# EAGLE design signalgen (EAGLE 7.1.0)
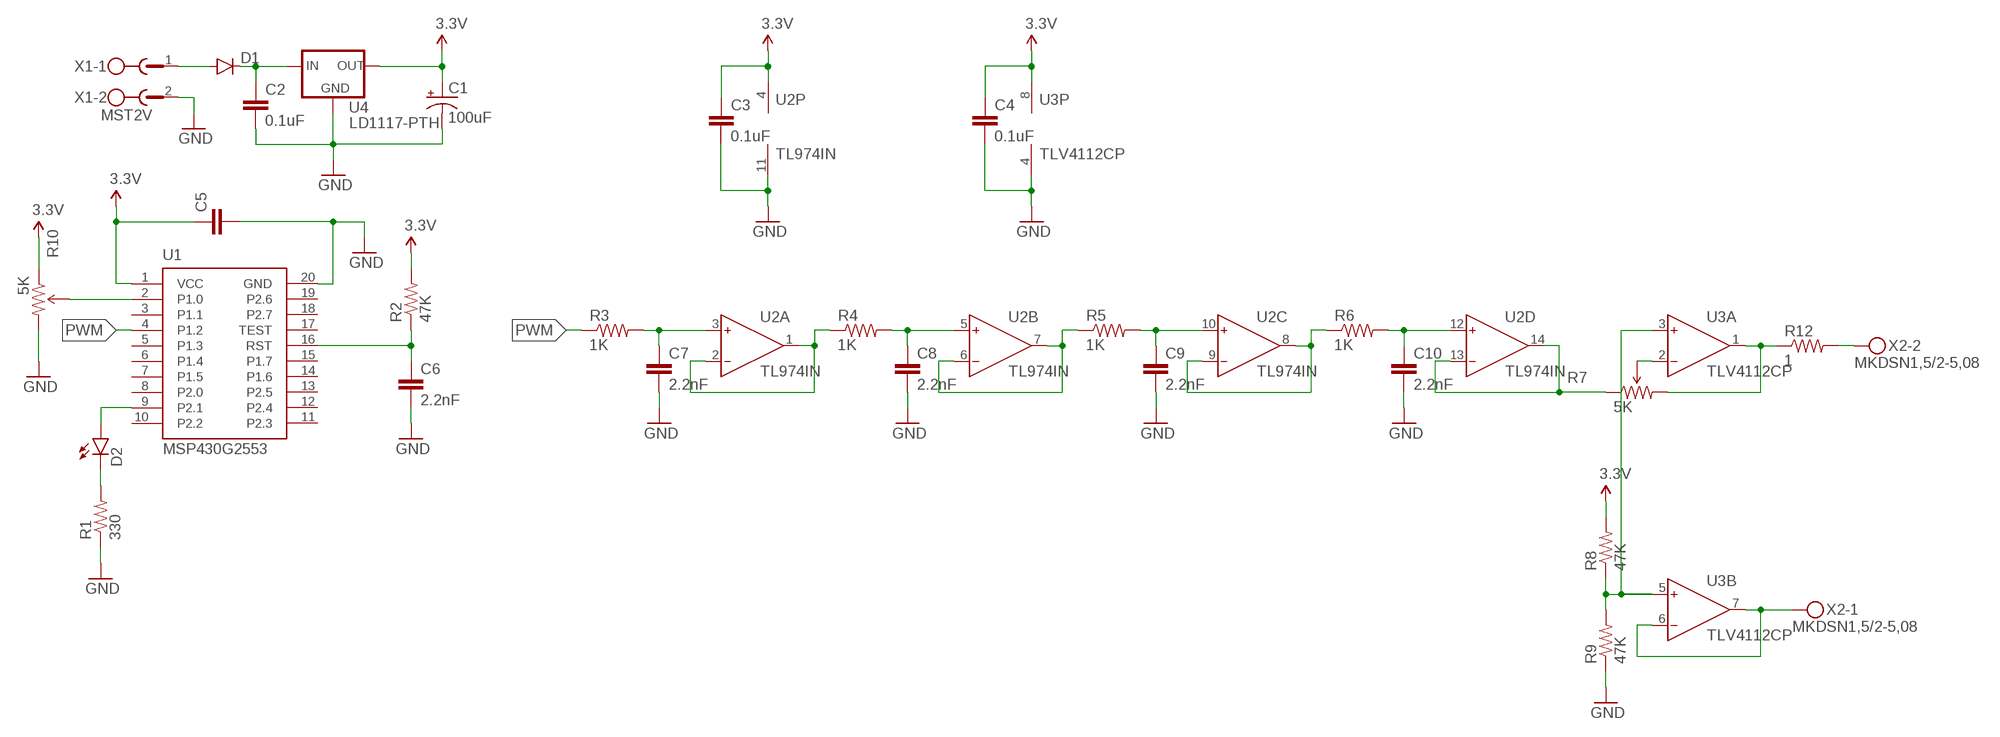
[diagram p0: schematic, sheet 1]

## Parts
C1  100uF  CAP_POLPTH1  [CPOL-RADIAL-100UF-25V]
C2  0.1uF  CAPPTH  [CAP-PTH-SMALL]
C3  0.1uF  CAPPTH  [CAP-PTH-SMALL]
C4  0.1uF  CAPPTH  [CAP-PTH-SMALL]
C5  CAPPTH  [CAP-PTH-SMALL]
C6  2.2nF  CAPPTH  [CAP-PTH-SMALL]
C7  2.2nF  CAPPTH  [CAP-PTH-SMALL]
C8  2.2nF  CAPPTH  [CAP-PTH-SMALL]
C9  2.2nF  CAPPTH  [CAP-PTH-SMALL]
C10  2.2nF  CAPPTH  [CAP-PTH-SMALL]
D1  DIODEPTH  [DIODE-1N4001]
D2  LED-3MM-NO_SILK  [LED3MM-NS]
R1  330  1KOHM-1/4W-1%(PTH)VERT  [AXIAL-0.1]
R2  47K  1KOHM-1/4W-1%(PTH)  [AXIAL-0.3]
R3  1K  1KOHM-1/4W-1%(PTH)VERT  [AXIAL-0.1]
R4  1K  1KOHM-1/4W-1%(PTH)  [AXIAL-0.3]
R5  1K  1KOHM-1/4W-1%(PTH)VERT  [AXIAL-0.1]
R6  1K  1KOHM-1/4W-1%(PTH)  [AXIAL-0.3]
R7  5K  TRIMPOTPTH  [TRIM_POT_PTH]
R8  47K  1KOHM-1/4W-1%(PTH)  [AXIAL-0.3]
R9  47K  1KOHM-1/4W-1%(PTH)  [AXIAL-0.3]
R10  5K  TRIMPOTPTH  [TRIM_POT_PTH]
R12  1  RESISTORPTH-1W  [AXIAL-0.6]
U1  MSP430G2553  [DIP-20]
U2  TL974IN  [DIP-14]
U3  TLV4112CP  [DIP-8]
U4  LD1117-PTH  [TO-220ABS]
X1  MST2V  [MSTBV2]
X2  MKDSN1,5/2-5,08  [MKDSN1,5/2-5,08]

## Nets
3.3V: C1.1(+) C3.1 C4.1 C5.1 R2.P$2 R8.P$2 R10.1(CCW) U1.1(VCC) U2.4(P:V+) U3.8(P:V+) U4.2(OUT)
GND: C1.2(-) C2.2 C3.2 C4.2 C5.2 C6.2 C7.2 C8.2 C9.2 C10.2 R1.P$1 R9.P$1 R10.3(CW) U1.20(GND) U2.11(P:V-) U3.4(P:V-) U4.1(GND) X1.2
N$1: D1.A X1.1
N$2: C2.1 D1.C U4.3(IN)
N$3: D2.K(C) R1.P$2
N$4: R4.P$1 U2.1(A:OUT) U2.2(A:IN-)
N$5: C7.1 R3.P$2 U2.3(A:IN+)
N$6: R5.P$1 U2.6(B:IN-) U2.7(B:OUT)
N$7: C6.1 R2.P$1 U1.16(RST)
N$8: U3.6(B:IN-) U3.7(B:OUT) X2.1
N$9: C8.1 R4.P$2 U2.5(B:IN+)
N$10: C10.1 R6.P$2 U2.12(D:IN+)
N$11: R12.P$2 X2.2
N$12: C9.1 R5.P$2 U2.10(C:IN+)
N$13: R6.P$1 U2.8(C:OUT) U2.9(C:IN-)
N$14: R7.1(CCW) U2.13(D:IN-) U2.14(D:OUT)
N$15: R8.P$1 R9.P$2 U3.3(A:IN+) U3.5(B:IN+)
N$16: R7.3(CW) R12.P$1 U3.1(A:OUT)
N$17: R10.2(WIPER) U1.2(P1.0)
N$18: R7.2(WIPER) U3.2(A:IN-)
N$19: D2.A U1.9(P2.1)
PWM: R3.P$1 U1.4(P1.2)
Unconnected: U1.3(P1.1) U1.5(P1.3) U1.6(P1.4) U1.7(P1.5) U1.8(P2.0) U1.10(P2.2) U1.11(P2.3) U1.12(P2.4) U1.13(P2.5) U1.14(P1.6) U1.15(P1.7) U1.17(TEST) U1.18(P2.7) U1.19(P2.6)

## Library data of the parts
C1 = SparkFun-Capacitors:CAP_POL: Capacitor Polarized These are standard SMD and PTH capacitors. Normally 10uF, 47uF, and 100uF in electrolytic and tantalum varieties. Always verify the external diameter of the through hole cap, it varies with capacity, voltage, and manufacturer. The EIA devices should be standard.
C2-C10 = SparkFun-Capacitors:CAP: Capacitor Standard 0603 ceramic capacitor, and 0.1" leaded capacitor.
D1 = SparkFun-DiscreteSemi:DIODE: Diode These are standard reverse protection diodes and small signal diodes. SMA package can handle up to about 1A. SOD-323 can handle about 200mA. What the SOD-323 package when ordering, there are some mfgs out there that are 5-pin packages.
D2 = SparkFun-LED:LED: LEDs Standard schematic elements and footprints for 5mm, 3mm, 1206, and 0603 sized LEDs. 5mm - Spark Fun Electronics SKU : COM-00529 (and others)
R1 R2 R8 R9 = SparkFun-Resistors:1KOHM-1/4W-1%(PTH): RES-12182; PROD_ID: RES-12182; VALUE: 1K
R3-R6 = SparkFun-Resistors:1KOHM-1/4W-1%(PTH): RES-12182; PROD_ID: RES-12182
R7 R10 = SparkFun-Electromechanical:TRIMPOT: Various small potentiometers for "set-and-forget" applications
R12 = SparkFun-Passives:RESISTOR: Resistor Basic schematic elements and footprints for 0603, 1206, and PTH resistors.
U1 = Custom:MSP430G2553
U2 = Custom:TL974IN: Quad Rail-to-Rail Very-Low-Noise Op Amp
U3 = Custom:TLV4112CP: Dual High Output Drive Op Amp
U4 = Custom:LD1117-PTH
X1 = con-phoenix-508:MST2V: PHOENIX; OC_FARNELL: unknown; OC_NEWARK: unknown
X2 = con-phoenix-508:MKDSN1,5/2-5,08: MKDSN 1,5/ 2-5,08 Printklemme Nennstrom: 13,5 A Nennspannung: 250 V Rastermaß: 5,08 mm Polzahl: 2 Anschlussart: Schraubanschluss Montage: Löten Anschlussrichtung Leiter/Platine: 0 ° Artikelnummer: 1729128 Source: http://eshop.phoenixcontact.com .. 1729128.pdf

## Board
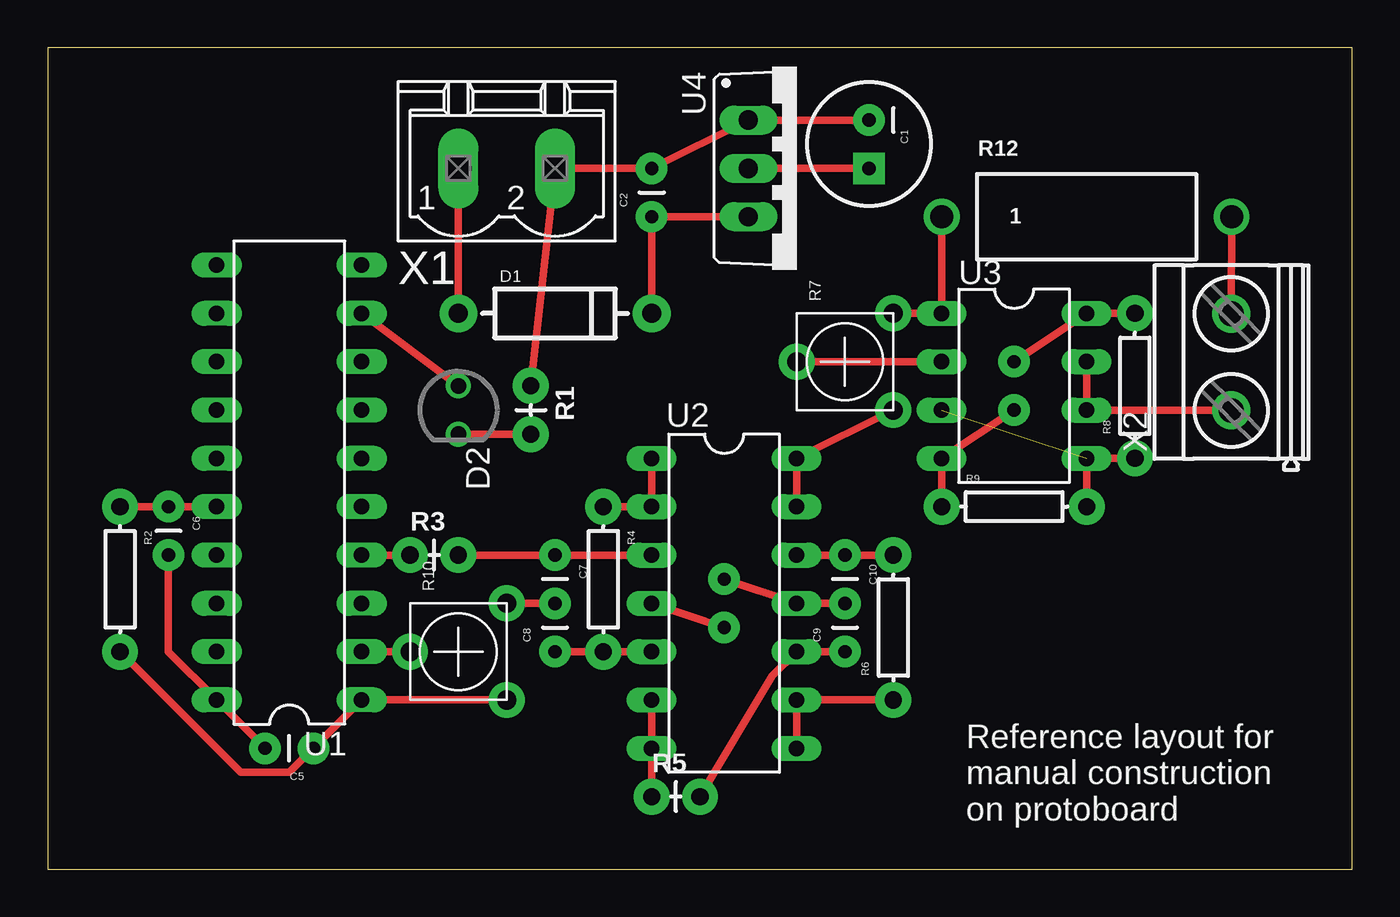
[diagram p1: board, top side]
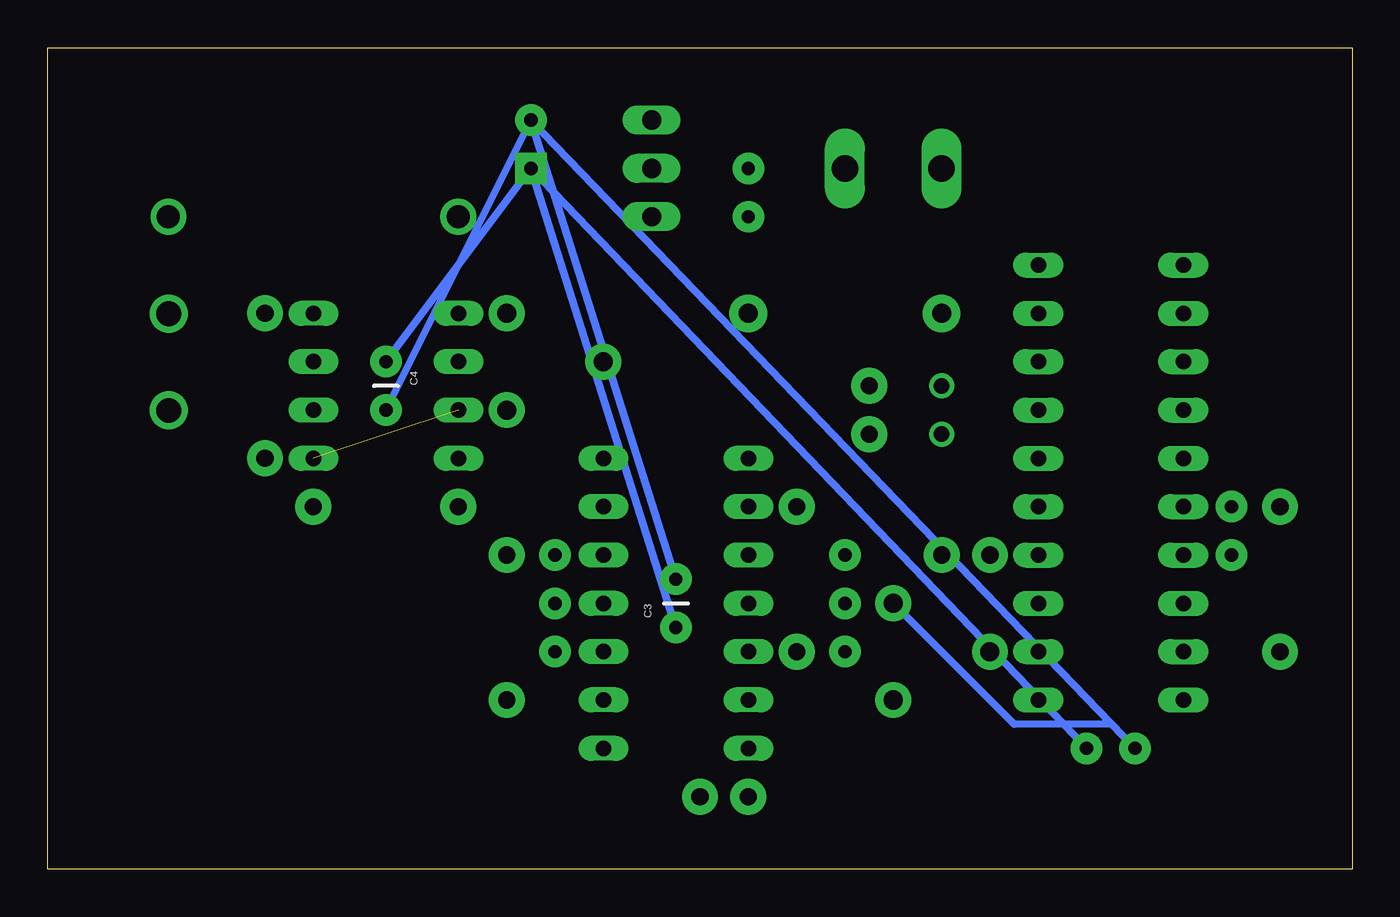
[diagram p2: board, bottom side, seen from below]

Size 68.58 x 43.18 mm. Coordinates in mm from the lower left corner, seen from the top.
Outline: 0,0 68.58,0 68.58,43.18 0,43.18 0,0
Copper layers (1*16): Top 0.035mm / dielectric 1.5mm / Bottom 0.035mm
Design rules "default": minimum track width 10mil, minimum drill 24mil, track to track 8mil, track to pad 8mil, pad to pad 8mil, via to via 8mil, smd to smd 8mil, copper to edge 40mil, drill to drill 8mil, minimum pad ring 10mil, minimum via ring 8mil, stop-mask expansion 4mil, vias tented up to drill 0mil, thermal gap 10mil

### Footprints (pad centres in the part's own frame; a part is rotated, then mirrored left to right if it is on the bottom)
CPOL-RADIAL-100UF-25V = drill 0.7 pad 1.651 square: 1 1.27,0 | drill 0.7 pad 1.651: 2 -1.27,0
CAP-PTH-SMALL = drill 0.7 pad 1.651: 1 0,0; 2 2.54,0
DIODE-1N4001 = drill 1 pad 1.981: A -5.08,0; C 5.08,0
LED3MM-NS = drill 0.813: A -1.27,0; K 1.27,0
AXIAL-0.1 = drill 0.9 pad 1.88: P$1 0,0; P$2 2.54,0
AXIAL-0.3 = drill 0.9 pad 1.88: P$1 -3.81,0; P$2 3.81,0
TRIM_POT_PTH = drill 1 pad 1.88: 1 -2.54,-2.54; 2 0,2.54; 3 2.54,-2.54
AXIAL-0.6 = drill 1.2 pad 1.88: P$1 -7.62,0; P$2 7.62,0
DIP-20 = drill 0.813 long: 1 -11.43,-3.81; 2 -8.89,-3.81; 3 -6.35,-3.81; 4 -3.81,-3.81; 5 -1.27,-3.81; 6 1.27,-3.81; 7 3.81,-3.81; 8 6.35,-3.81; 9 8.89,-3.81; 10 11.43,-3.81; 11 11.43,3.81; 12 8.89,3.81; 13 6.35,3.81; 14 3.81,3.81; 15 1.27,3.81; 16 -1.27,3.81; 17 -3.81,3.81; 18 -6.35,3.81; 19 -8.89,3.81; 20 -11.43,3.81
DIP-14 = drill 0.813 long: 1 -7.62,-3.81; 2 -5.08,-3.81; 3 -2.54,-3.81; 4 0,-3.81; 5 2.54,-3.81; 6 5.08,-3.81; 7 7.62,-3.81; 8 7.62,3.81; 9 5.08,3.81; 10 2.54,3.81; 11 0,3.81; 12 -2.54,3.81; 13 -5.08,3.81; 14 -7.62,3.81
DIP-8 = drill 0.813 long: 1 -3.81,-3.81; 2 -1.27,-3.81; 3 1.27,-3.81; 4 3.81,-3.81; 5 3.81,3.81; 6 1.27,3.81; 7 -1.27,3.81; 8 -3.81,3.81
TO-220ABS = drill 1.016 long: 1 -2.54,0; 2 0,0; 3 2.54,0
MSTBV2 = drill 1.397 long: 1 -2.54,0; 2 2.54,0
MKDSN1,5/2-5,08 = drill 1.3 pad 2: 1 -2.561,0.025; 2 2.519,0.025

### Placement (x,y rotation side)
C1  43.18,38.1 270 top
C2  31.75,34.29 90 top
C3  35.56,12.7 90 bottom
C4  50.8,26.67 270 bottom
C5  13.97,6.35 180 top
C6  6.35,19.05 270 top
C7  26.67,16.51 270 top
C8  26.67,11.43 90 top
C9  41.91,11.43 90 top
C10  41.91,16.51 270 top
D1  26.67,29.21 0 top
D2  21.59,24.13 270 top
R1  25.4,25.4 270 top
R2  3.81,15.24 270 top
R3  19.05,16.51 0 top
R4  29.21,15.24 270 top
R5  31.75,3.81 0 top
R6  44.45,12.7 90 top
R7  41.91,26.67 90 top
R8  57.15,25.4 90 top
R9  50.8,19.05 0 top
R10  21.59,11.43 90 top
R12  54.61,34.29 0 top
U1  12.7,20.32 90 top
U2  35.56,13.97 270 top
U3  50.8,25.4 270 top
U4  36.83,36.83 270 top
X1  24.13,36.83 0 top
X2  62.23,26.67 90 top

### Tracks (layer width: path | path; a pad name or v marks a point on that pad's centre or on a via)
3.3V
  Top 0.406: U4.2 C1.1 | R8.P$2 U3.8 C4.1 | C3.1 U2.4 | R10.1 U1.1 C5.1 12.7,5.08 10.16,5.08 R2.P$2
  Bottom 0.406: C1.1 C5.1 | C1.1 C3.1 | C1.1 C4.1
GND
  Top 0.406: R1.P$1 X1.2 C2.2 U4.1 C1.2 | C5.2 U1.20 6.35,11.43 C6.2 | R9.P$1 U3.4 C4.2 | C10.2 U2.11 C3.2 | R10.3 C8.2
  Bottom 0.406: C1.2 12.68,7.64 | 12.68,7.64 C5.2 | C1.2 C3.2 | C1.2 C4.2 | R10.3 17.78,7.62 12.68,7.64
N$1
  Top 0.406: D1.A X1.1
N$2
  Top 0.406: U4.3 C2.1 D1.C
N$3
  Top 0.406: D2.K R1.P$2
N$4
  Top 0.406: R4.P$1 U2.2 U2.1
N$5
  Top 0.406: R3.P$2 C7.1 U2.3
N$6
  Top 0.406: U2.6 U2.7 R5.P$1
N$7
  Top 0.406: U1.16 C6.1 R2.P$1
N$8
  Top 0.406: U3.7 U3.6 X2.1
N$9
  Top 0.406: C8.1 R4.P$2 U2.5
N$10
  Top 0.406: U2.12 C10.1 R6.P$2
N$11
  Top 0.406: X2.2 R12.P$2
N$12
  Top 0.406: C9.1 U2.10 38.1,10.16 R5.P$2
N$13
  Top 0.406: U2.8 U2.9 R6.P$1
N$14
  Top 0.406: U2.13 U2.14 R7.1
N$15  (1 unrouted)
  Top 0.406: R8.P$1 U3.5 R9.P$2
N$16
  Top 0.406: R12.P$1 U3.1 R7.3
N$17
  Top 0.406: U1.2 R10.2
N$18
  Top 0.406: R7.2 U3.2
N$19
  Top 0.406: U1.9 D2.A
PWM
  Top 0.406: U1.4 R3.P$1

### Text on the board
tPlace: Reference layout for / manual construction / on protoboard